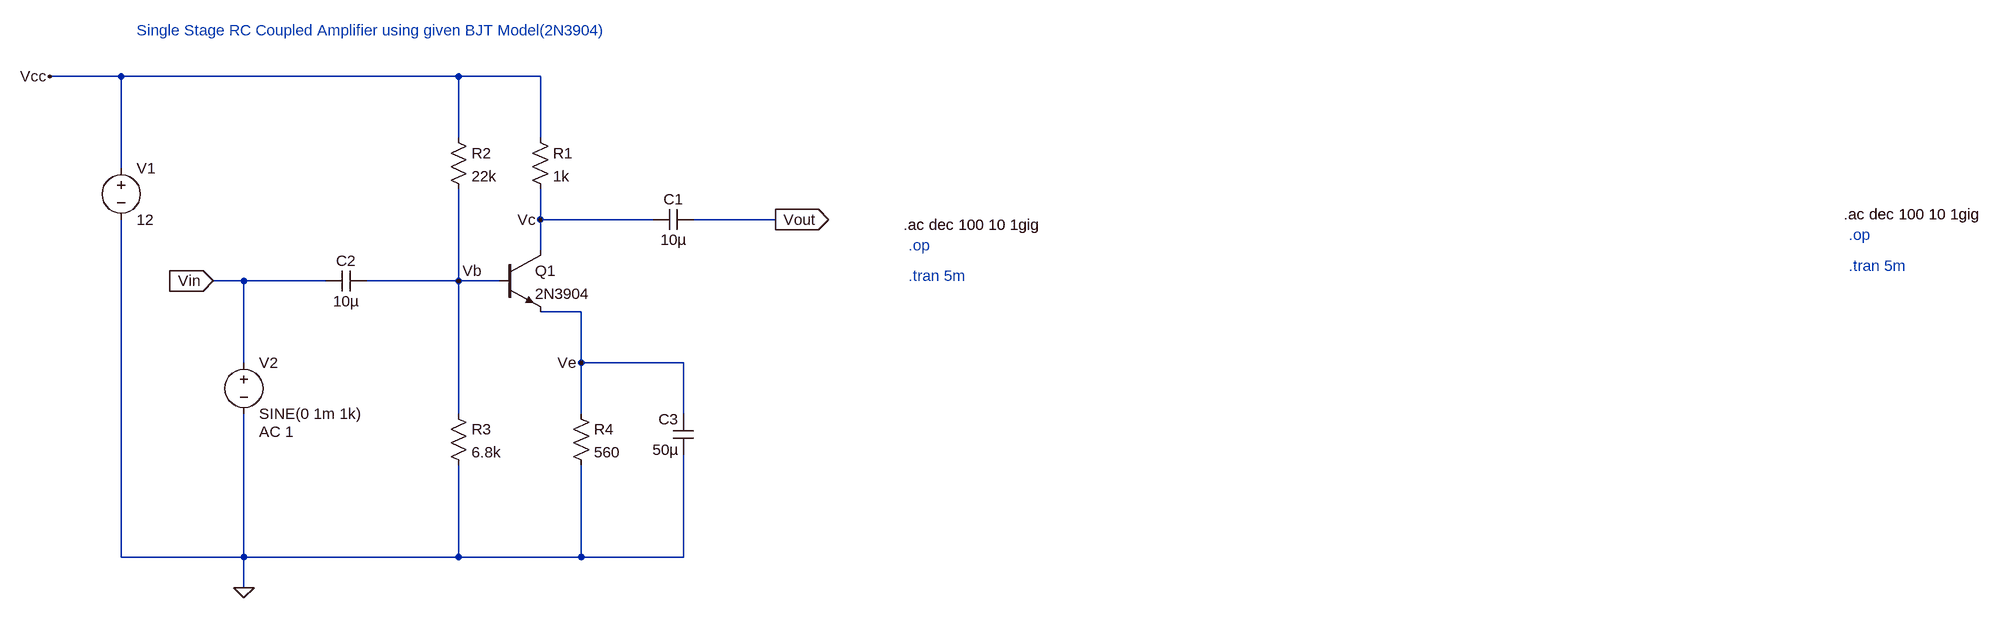
[diagram p0: schematic assigment1.asc]
assigment1.asc, the LTspice schematic file:
Version 4
SHEET 1 2492 680
WIRE -432 -208 -544 -208
WIRE 96 -208 -432 -208
WIRE 224 -208 96 -208
WIRE 96 -112 96 -208
WIRE 224 -112 224 -208
WIRE -432 -64 -432 -208
WIRE 224 16 224 -32
WIRE 400 16 224 16
WIRE 592 16 464 16
WIRE 224 64 224 16
WIRE -240 112 -288 112
WIRE -112 112 -240 112
WIRE 96 112 96 -32
WIRE 96 112 -48 112
WIRE 160 112 96 112
WIRE 288 160 224 160
WIRE -240 240 -240 112
WIRE 288 240 288 160
WIRE 448 240 288 240
WIRE 96 320 96 112
WIRE 288 320 288 240
WIRE 448 320 448 240
WIRE -432 544 -432 16
WIRE -240 544 -240 320
WIRE -240 544 -432 544
WIRE 96 544 96 400
WIRE 96 544 -240 544
WIRE 288 544 288 400
WIRE 288 544 96 544
WIRE 448 544 448 384
WIRE 448 544 288 544
WIRE -240 592 -240 544
FLAG 96 112 Vb
FLAG 288 240 Ve
FLAG -288 112 Vin
IOPIN -288 112 In
FLAG 592 16 Vout
IOPIN 592 16 Out
FLAG -544 -208 Vcc
FLAG -240 592 0
FLAG 224 16 Vc
SYMBOL npn 160 64 R0
SYMATTR InstName Q1
SYMATTR Value 2N3904
SYMBOL res 208 -128 R0
SYMATTR InstName R1
SYMATTR Value 1k
SYMBOL res 80 -128 R0
SYMATTR InstName R2
SYMATTR Value 22k
SYMBOL res 80 304 R0
SYMATTR InstName R3
SYMATTR Value 6.8k
SYMBOL res 272 304 R0
SYMATTR InstName R4
SYMATTR Value 560
SYMBOL cap -48 96 R90
WINDOW 0 0 32 VBottom 2
WINDOW 3 32 32 VTop 2
SYMATTR InstName C2
SYMATTR Value 10µ
SYMBOL cap 464 0 R90
WINDOW 0 0 32 VBottom 2
WINDOW 3 32 32 VTop 2
SYMATTR InstName C1
SYMATTR Value 10µ
SYMBOL cap 464 384 R180
WINDOW 0 24 56 Left 2
WINDOW 3 24 8 Left 2
SYMATTR InstName C3
SYMATTR Value 50µ
SYMBOL voltage -432 -80 R0
SYMATTR InstName V1
SYMATTR Value 12
SYMBOL voltage -240 224 R0
WINDOW 123 24 124 Left 2
WINDOW 39 0 0 Left 0
SYMATTR Value2 AC 1
SYMATTR InstName V2
SYMATTR Value SINE(0 1m 1k)
TEXT 792 24 Left 2 !.ac dec 100 10 1gig
TEXT 800 56 Left 2 ;.op
TEXT 800 104 Left 2 ;.tran 5m
TEXT -408 -280 Left 2 ;Single Stage RC Coupled Amplifier using given BJT Model(2N3904)
TEXT 2264 8 Left 2 !.ac dec 100 10 1gig
TEXT 2272 40 Left 2 ;.op
TEXT 2272 88 Left 2 ;.tran 5m

The netlist it stands for:
* assigment1.asc
Q1 Vc Vb Ve 0 2N3904
R1 Vcc Vc 1k
R2 Vcc Vb 22k
R3 Vb 0 6.8k
R4 Ve 0 560
C2 Vb Vin 10µ
C1 Vout Vc 10µ
C3 0 Ve 50µ
V1 Vcc 0 12
V2 Vin 0 SINE(0 1m 1k) AC 1
.model NPN NPN
.model PNP PNP
.lib standard.bjt
.ac dec 100 10 1gig
* .op
* .tran 5m
* Single Stage RC Coupled Amplifier using given BJT Model(2N3904)
.ac dec 100 10 1gig
* .op
* .tran 5m
.backanno
.end